# EAGLE design satellite (EAGLE 6.1)
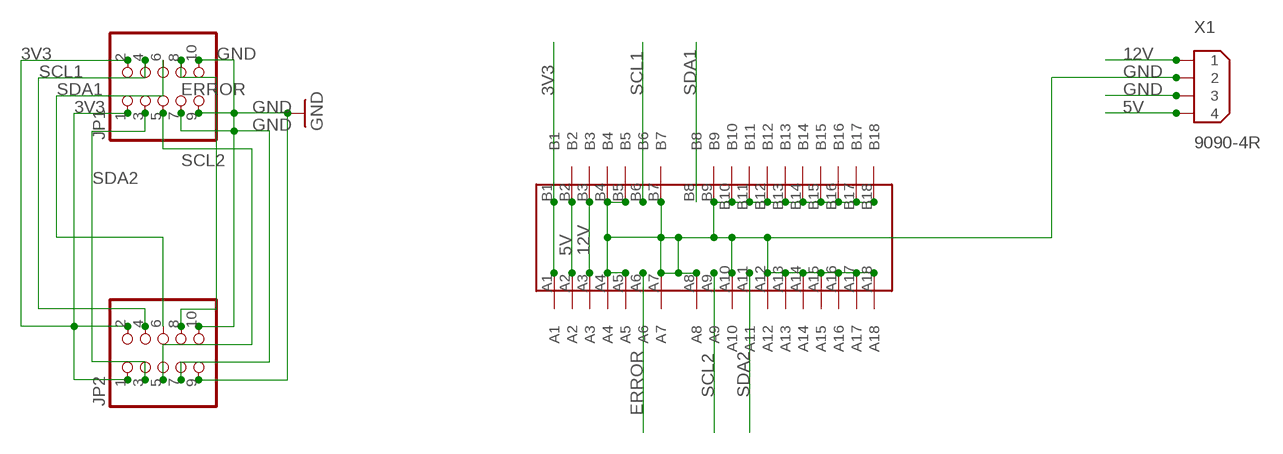
[diagram p0: schematic, sheet 1]

## Parts
JP1  PINHD-2X5  [2X05]
JP2  PINHD-2X5  [2X05]
U$1  PCIE1X  [PCIE1X]
X1  9090-4R  [9090-4R]

## Nets
3V3: JP1.1 JP1.2 JP2.1 JP2.2 U$1.A1 U$1.B1
5V: U$1.A2 U$1.B2 X1.4
12V: U$1.A3 U$1.B3 X1.1
ERROR: JP1.8 JP2.8 U$1.A6
GND: JP1.7 JP1.9 JP1.10 JP2.7 JP2.9 JP2.10 U$1.A4 U$1.A5 U$1.A7 U$1.A8 U$1.A10 U$1.A12 U$1.A13 U$1.A14 U$1.A15 U$1.A16 U$1.A17 U$1.A18 U$1.B4 U$1.B5 U$1.B7 U$1.B9 U$1.B10 U$1.B11 U$1.B12 U$1.B13 U$1.B14 U$1.B15 U$1.B16 U$1.B17 U$1.B18 X1.2 X1.3
SCL1: JP1.4 JP2.4 U$1.B6
SCL2: JP1.5 JP2.5 U$1.A9
SDA1: JP1.6 JP2.6 U$1.B8
SDA2: JP1.3 JP2.3 U$1.A11

## Library data of the parts
JP1 JP2 = pinhead:PINHD-2X5: PIN HEADER
U$1 = pcie1x:PCIE1X
X1 = con-thomas-betts:9090-4: Disk Drive Power four position Source: Thomas & Betts Electronic Interconnects Eiropean Edition 1998

## Net classes
0 default: width 0.203 mm, drill 0.203 mm, clearance 0.203 mm

## Board
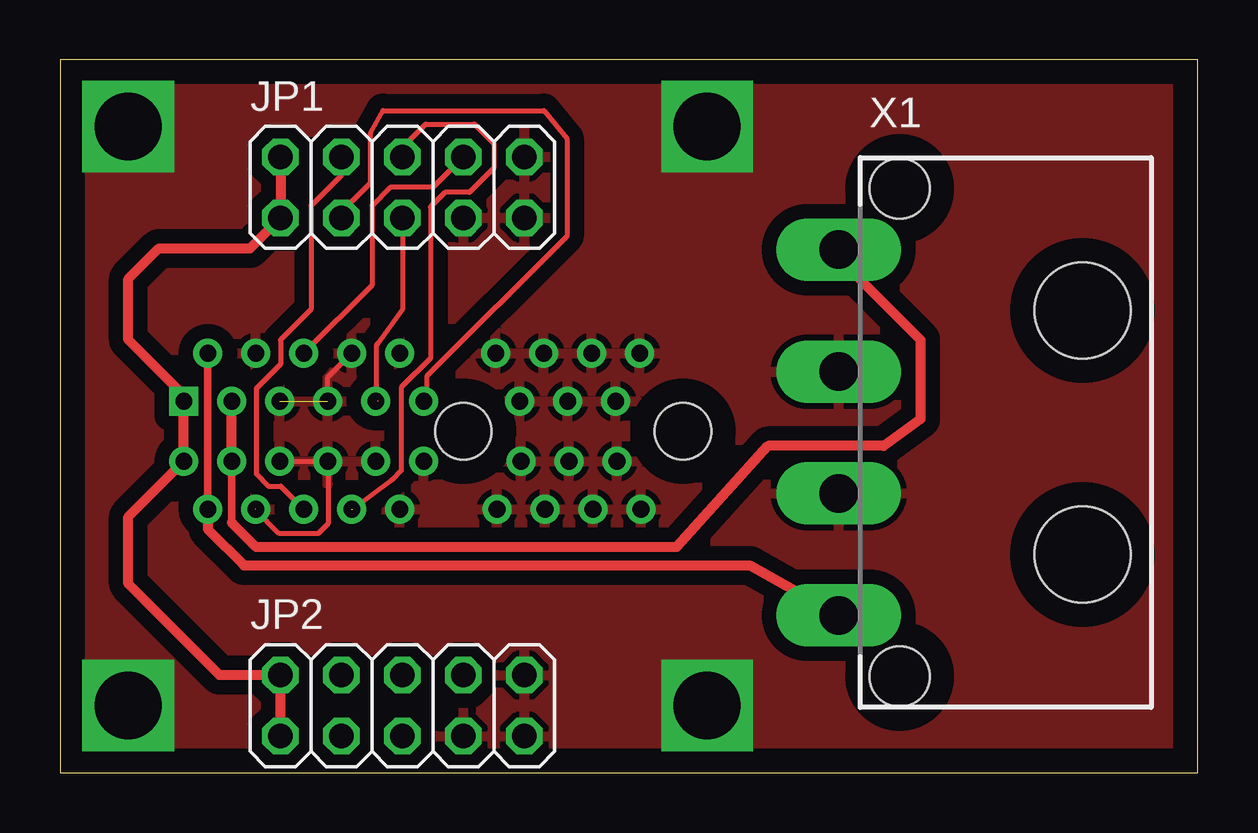
[diagram p1: board, top side]
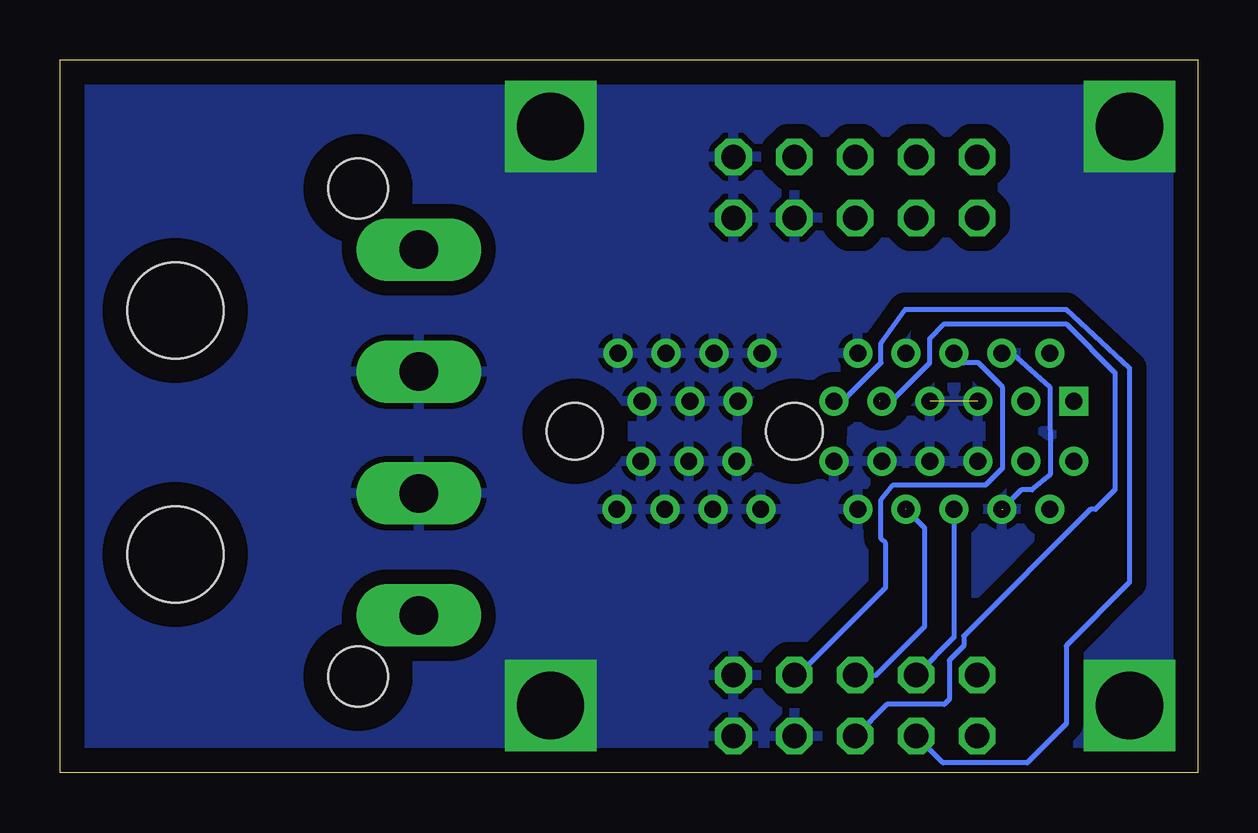
[diagram p2: board, bottom side, seen from below]

Size 47.43 x 29.69 mm. Coordinates in mm from the lower left corner, seen from the top.
Outline: 0,0 47.43,0 47.43,29.69 0,29.69 0,0
Copper layers (1*16): Top 0.035mm / dielectric 1.5mm / Bottom 0.035mm
Design rules: minimum track width 8mil, minimum drill 8mil, track to track 8mil, track to pad 8mil, pad to pad 8mil, via to via 8mil, smd to smd 8mil, copper to edge 40mil, drill to drill 8mil, minimum pad ring 10mil, minimum via ring 8mil, stop-mask expansion 4mil, vias tented up to drill 0mil, thermal gap 10mil

### Footprints (pad centres in the part's own frame; a part is rotated, then mirrored left to right if it is on the bottom)
2X05 = drill 1.016 octagon: 1 -5.08,-1.27; 2 -5.08,1.27; 3 -2.54,-1.27; 4 -2.54,1.27; 5 0,-1.27; 6 0,1.27; 7 2.54,-1.27; 8 2.54,1.27; 9 5.08,-1.27; 10 5.08,1.27
PCIE1X = drill 0.7 square: A1 -11.65,1.25 | drill 0.7: A2 -10.65,3.25; A3 -9.65,1.25; A4 -8.65,3.25; A5 -7.65,1.25; A6 -6.65,3.25; A7 -5.65,1.25; A8 -4.65,3.25; A9 -3.65,1.25; A10 -2.65,3.25; A11 -1.65,1.25; A12 1.35,3.25; A13 2.35,1.25; A14 3.35,3.25; A15 4.35,1.25; A16 5.35,3.25; A17 6.35,1.25; A18 7.35,3.25; B1 -11.65,-1.25; B2 -10.65,-3.25; B3 -9.65,-1.25; B4 -8.65,-3.25; B5 -7.65,-1.25; B6 -6.65,-3.25; B7 -5.65,-1.25; B8 -4.65,-3.25; B9 -3.65,-1.25; B10 -2.65,-3.25; B11 -1.65,-1.25; B12 1.4,-3.25; B13 2.4,-1.25; B14 3.4,-3.25; B15 4.4,-1.25; B16 5.4,-3.25; B17 6.4,-1.25; B18 7.4,-3.25 | hole 2.35: 9.15,0; 0,0
9090-4R = drill 1.6 pad 2.6 long: 1 -7.62,-6.35; 2 -2.54,-6.35; 3 2.54,-6.35; 4 7.62,-6.35 | hole 4: -5.08,3.81; 5.08,3.81 | hole 2.5: -10.16,-3.81; 10.16,-3.81

### Placement (x,y rotation side)
JP1  14.27,24.38 0 top
JP2  14.27,2.79 0 top
U$1  16.81,14.22 0 top
X1  38.81,14.17 270 top

### Tracks (layer width: path | path; a pad name or v marks a point on that pad's centre or on a via)
3V3
  Top 0.406: JP2.1 JP2.2 6.65,4.06 2.84,7.87 2.84,10.65 U$1.B1 U$1.A1 5.16,15.71 2.84,18.03 2.84,20.57 4.11,21.84 7.92,21.84 JP1.1 JP1.2
5V
  Top 0.305: U$1.B2 U$1.A2
  Top 0.406: U$1.B2 6.16,10.14 7.67,8.64 28.75,8.64 X1.4
12V
  Top 0.203: U$1.A3 7.16,15.49
  Top 0.305: 7.16,10.41 7.16,15.49
  Top 0.406: X1.1 33.32,20.57 35.86,18.03 35.86,14.73 34.34,13.61 29.51,13.61 25.7,9.4 8.18,9.4 7.16,10.41 | U$1.B3 U$1.A3
ERROR
  Top 0.203: JP1.8 15.54,24.38 13.77,24.38 13,23.62 13,20.31 U$1.A6
  Bottom 0.203: JP2.8 16.66,4.06 13,7.72 13,9.55 13.21,9.75 13.21,11.38 12.7,11.99 8.84,11.99 8.13,12.7 8.13,16.05 9.14,17.07 9.76,17.07 U$1.A6
GND  (via drill 2.8)  (2 unrouted)
  Top 0.203: U$1.B5 11,12.97 11.18,12.8 11.18,10.36 10.77,9.96 9.14,9.96 8.13,10.97 | U$1.A7 11.16,16.47 U$1.A8
  Bottom 0.203: U$1.A4 7.72,17.47 6.17,16.08 6.15,12.42 6.91,11.79 7.35,11.79 U$1.B4
  other vias: 2.84,2.79 2.84,26.92 26.97,26.92 26.97,2.79
  pour Top (isolate 0.61): 0.3,29.46 0.3,-1.02 47.29,-1.02 47.29,29.46
  pour Bottom (isolate 0.61): 0.3,29.46 0.3,-1.02 47.29,-1.02 47.29,29.46
SCL1
  Top 0.203: JP1.4 11.73,24.89 10.46,23.62 10.46,19.3 9.19,18.03 9.19,17.02 8.18,16 8.18,12.45 8.69,11.94 9.2,11.94 U$1.B6
  Bottom 0.203: U$1.B6 10.16,5.63 JP2.4
SCL2  (1 unrouted)
  Top 0.203: JP1.5 14.27,19.3 13.26,17.88 13.18,17.8 13.18,15.52 13.23,15.47 13.21,15.47 13.18,15.44 13.13,15.44 13.11,15.47 13.11,15.49 13.13,15.52 13.16,15.52 13.18,15.49 13.23,15.49 13.26,15.47 | 13.26,15.49 13.18,15.49 U$1.A9
  Bottom 0.203: U$1.A9 12.77,15.47 11.18,17.07 11.18,18.09 10.57,18.69 5.49,18.69 3.45,16.66 3.45,11.79 4.27,10.97 4.47,10.97 9.75,5.69 9.75,5.28 10.36,4.67 10.36,3.05 10.57,2.85 12.95,2.85 JP2.5
SDA1  (1 unrouted)
  Top 0.203: JP1.6 14.27,26.06 15.24,27.03 17.27,27.03 18.08,26.21 18.08,25.2 17.07,24.18 16.05,24.18 15.44,23.57 15.44,17.27 14.22,16.05 14.22,12.6 13.82,12.19 12.19,10.97
  Bottom 0.203: JP2.6 13.41,4.06 11.38,6.1 11.38,10.19 U$1.B8
SDA2
  Top 0.203: JP1.3 11.73,23.37 12.95,24.59 12.95,26.67 13.46,27.58 20.17,27.58 21.13,26.42 21.13,22.35 15.29,16.51 15.29,15.6 U$1.A11
  Bottom 0.203: U$1.A11 14.8,15.47 13.21,17.07 13.21,17.88 12.19,19.3 5.49,19.3 2.84,16.87 2.84,7.93 5.49,5.28 5.49,2.03 7.11,0.41 10.62,0.41 JP2.3